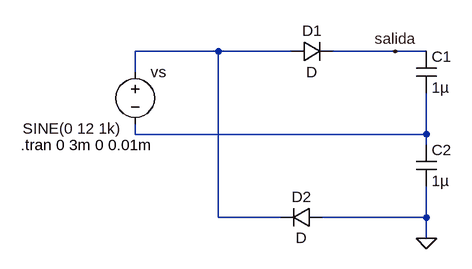
[diagram p0: schematic Draft16.asc]
Draft16.asc, the LTspice schematic file:
Version 4
SHEET 1 880 680
WIRE 160 48 32 48
WIRE 272 48 160 48
WIRE 432 48 336 48
WIRE 480 48 432 48
WIRE 32 80 32 48
WIRE 32 176 32 160
WIRE 480 176 480 112
WIRE 480 176 32 176
WIRE 480 192 480 176
WIRE 160 304 160 48
WIRE 256 304 160 304
WIRE 480 304 480 256
WIRE 480 304 320 304
WIRE 480 336 480 304
FLAG 480 336 0
FLAG 432 48 salida
SYMBOL voltage 32 64 R0
WINDOW 3 -173 103 Left 2
WINDOW 123 0 0 Left 0
WINDOW 39 0 0 Left 0
SYMATTR InstName vs
SYMATTR Value SINE(0 12 1k)
SYMBOL diode 272 64 R270
WINDOW 0 32 32 VTop 2
WINDOW 3 0 32 VBottom 2
SYMATTR InstName D1
SYMBOL diode 320 288 R90
WINDOW 0 0 32 VBottom 2
WINDOW 3 32 32 VTop 2
SYMATTR InstName D2
SYMBOL cap 464 48 R0
SYMATTR InstName C1
SYMATTR Value 1µ
SYMBOL cap 464 192 R0
SYMATTR InstName C2
SYMATTR Value 1µ
TEXT -144 192 Left 2 !.tran 0 3m 0 0.01m

The netlist it stands for:
* Draft16.asc
vs N001 N002 SINE(0 12 1k)
D1 N001 salida D
D2 0 N001 D
C1 salida N002 1µ
C2 N002 0 1µ
.model D D
.lib standard.dio
.tran 0 3m 0 0.01m
.backanno
.end